# Altium schematic sheet InputCurrentSensingSketch.SchDoc
size A4; SheetNumber: 4; SheetTotal: 8
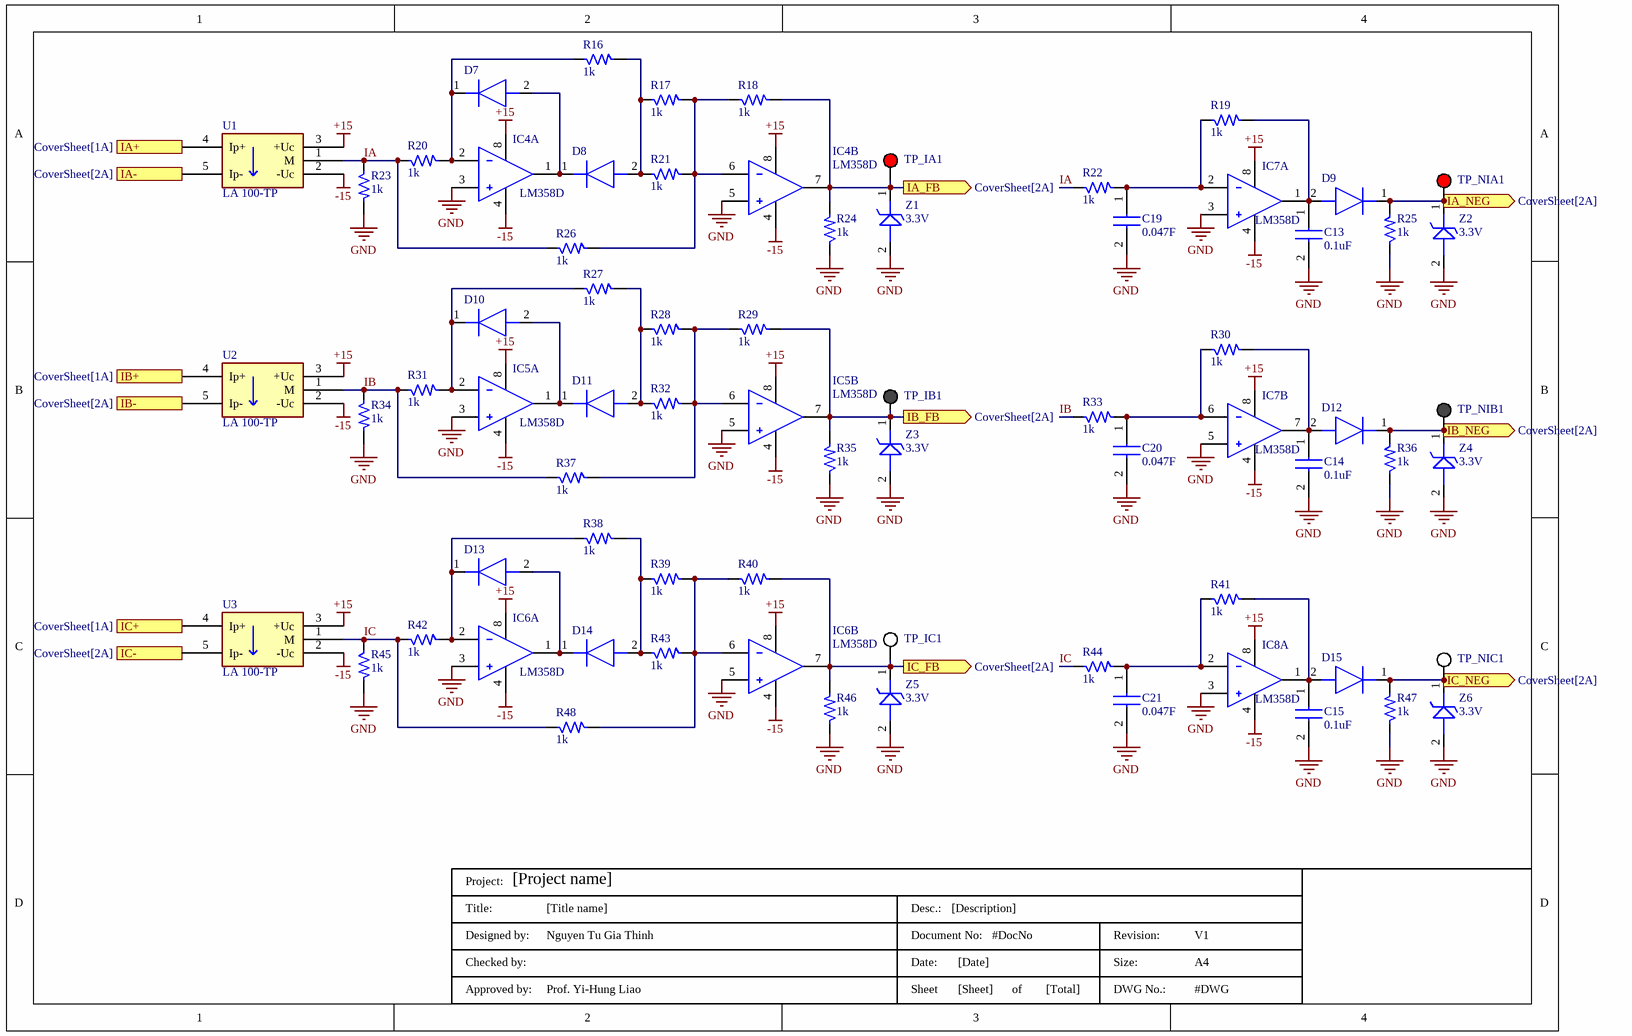
[diagram p0: InputCurrentSensingSketch.SchDoc]

## Parts
C13  0.1uF  [C0805]
C14  0.1uF  [C0805]
C15  0.1uF  [C0805]
C19  value 0.047F  [C0805]  (hidden comment: C0805C473F3GECAUTO7210)
C20  value 0.047F  [C0805]  (hidden comment: C0805C473F3GECAUTO7210)
C21  value 0.047F  [C0805]  (hidden comment: C0805C473F3GECAUTO7210)
D7  MBRM130LT1G  [MBRM130LT1G]  (value not drawn)
D8  MBRM130LT1G  [MBRM130LT1G]  (value not drawn)
D9  MBRM130LT1G  [MBRM130LT1G]  (value not drawn)
D10  MBRM130LT1G  [MBRM130LT1G]  (value not drawn)
D11  MBRM130LT1G  [MBRM130LT1G]  (value not drawn)
D12  MBRM130LT1G  [MBRM130LT1G]  (value not drawn)
D13  MBRM130LT1G  [MBRM130LT1G]  (value not drawn)
D14  MBRM130LT1G  [MBRM130LT1G]  (value not drawn)
D15  MBRM130LT1G  [MBRM130LT1G]  (value not drawn)
IC4  LM358D  [SOIC127P600X175-8N]  (parts A,B of 2)
IC5  LM358D  [SOIC127P600X175-8N]  (parts A,B of 2)
IC6  LM358D  [SOIC127P600X175-8N]  (parts A,B of 2)
IC7  LM358D  [SOIC127P600X175-8N]  (parts A,B of 2)
IC8  LM358D  [SOIC127P600X175-8N]  (part A of 2)
R16  1k  [SM-1206]
R17  1k  [SM-1206]
R18  1k  [SM-1206]
R19  1k  [SM-1206]
R20  1k  [SM-1206]
R21  1k  [SM-1206]
R22  1k  [SM-1206]
R23  1k  [SM-1206]
R24  1k  [SM-1206]
R25  1k  [SM-1206]
R26  1k  [SM-1206]
R27  1k  [SM-1206]
R28  1k  [SM-1206]
R29  1k  [SM-1206]
R30  1k  [SM-1206]
R31  1k  [SM-1206]
R32  1k  [SM-1206]
R33  1k  [SM-1206]
R34  1k  [SM-1206]
R35  1k  [SM-1206]
R36  1k  [SM-1206]
R37  1k  [SM-1206]
R38  1k  [SM-1206]
R39  1k  [SM-1206]
R40  1k  [SM-1206]
R41  1k  [SM-1206]
R42  1k  [SM-1206]
R43  1k  [SM-1206]
R44  1k  [SM-1206]
R45  1k  [SM-1206]
R46  1k  [SM-1206]
R47  1k  [SM-1206]
R48  1k  [SM-1206]
TitleBlock  DWG No.: #DWG  Size:: A4  Revision:: V1  Total of Sheets: [Total]  Sheet: [Sheet]  Date:: [Date]  Document No:: #DocNo  Desc.:: [Description]  Approved by:: Prof. Yi-Hung Liao  Designed by:: Nguyen Tu Gia Thinh  Title:: [Title name]  Project: [Project name]  (hidden comment: TitleBlock)  (graphical)
TP_IA1  (no value)  [5000]
TP_IB1  (no value)  [5001]
TP_IC1  (no value)  [5002]
TP_NIA1  (no value)  [5000]
TP_NIB1  (no value)  [5001]
TP_NIC1  (no value)  [5002]
U1  LA 100-TP  [LA 100-TP]
U2  LA 100-TP  [LA 100-TP]
U3  LA 100-TP  [LA 100-TP]
Z1  3.3V  [DIOM5226X230N]
Z2  3.3V  [DIOM5226X230N]
Z3  3.3V  [DIOM5226X230N]
Z4  3.3V  [DIOM5226X230N]
Z5  3.3V  [DIOM5226X230N]
Z6  3.3V  [DIOM5226X230N]

## Ports
IA+ (in, see CoverSheet[1A]), IA- (out, see CoverSheet[2A]), IA_FB (out, see CoverSheet[2A]), IA_NEG (out, see CoverSheet[2A]), IB+ (in, see CoverSheet[1A]), IB- (out, see CoverSheet[2A]), IB_FB (out, see CoverSheet[2A]), IB_NEG (out, see CoverSheet[2A]), IC+ (in, see CoverSheet[1A]), IC- (out, see CoverSheet[2A]), IC_FB (out, see CoverSheet[2A]), IC_NEG (out, see CoverSheet[2A])

## Nets
+15: IC4.8(V+) IC5.8(V+) IC6.8(V+) IC7.8(V+) IC8.8(V+) U1.3(+Uc) U2.3(+Uc) U3.3(+Uc)
-15: IC4.4(V-) IC5.4(V-) IC6.4(V-) IC7.4(V-) IC8.4(V-) U1.2(-Uc) U2.2(-Uc) U3.2(-Uc)
GND: C13.2 C14.2 C15.2 C19.2 C20.2 C21.2 IC4.3(IN1+) IC4.5(IN2+) IC5.3(IN1+) IC5.5(IN2+) IC6.3(IN1+) IC6.5(IN2+) IC7.3(IN1+) IC7.5(IN2+) IC8.3(IN1+) R23.2 R24.1 R25.1 R34.2 R35.1 R36.1 R45.2 R46.1 R47.1 Z1.2(A) Z2.2(A) Z3.2(A) Z4.2(A) Z5.2(A) Z6.2(A)
IA: R20.1 R22.1 R23.1 R26.1 U1.1(M)
IA+: U1.4(Ip+) ; port IA+
IA-: U1.5(Ip-) ; port IA-
IA_FB: IC4.7(OUT2) R18.2 R24.2 TP_IA1.1 Z1.1(K) ; port IA_FB
IA_NEG: D9.1(K) R25.2 TP_NIA1.1 Z2.1(K) ; port IA_NEG
IB: R31.1 R33.1 R34.1 R37.1 U2.1(M)
IB+: U2.4(Ip+) ; port IB+
IB-: U2.5(Ip-) ; port IB-
IB_FB: IC5.7(OUT2) R29.2 R35.2 TP_IB1.1 Z3.1(K) ; port IB_FB
IB_NEG: D12.1(K) R36.2 TP_NIB1.1 Z4.1(K) ; port IB_NEG
IC: R42.1 R44.1 R45.1 R48.1 U3.1(M)
IC+: U3.4(Ip+) ; port IC+
IC-: U3.5(Ip-) ; port IC-
IC_FB: IC6.7(OUT2) R40.2 R46.2 TP_IC1.1 Z5.1(K) ; port IC_FB
IC_NEG: D15.1(K) R47.2 TP_NIC1.1 Z6.1(K) ; port IC_NEG
NetC13_1: C13.1 D9.2(A) IC7.1(OUT1) R19.2
NetC14_1: C14.1 D12.2(A) IC7.7(OUT2) R30.2
NetC15_1: C15.1 D15.2(A) IC8.1(OUT1) R41.2
NetC19_1: C19.1 IC7.2(IN1-) R19.1 R22.2
NetC20_1: C20.1 IC7.6(IN2-) R30.1 R33.2
NetC21_1: C21.1 IC8.2(IN1-) R41.1 R44.2
NetD7_1: D7.1(K) IC4.2(IN1-) R16.1 R20.2
NetD7_2: D7.2(A) D8.1(K) IC4.1(OUT1)
NetD8_2: D8.2(A) R16.2 R17.1 R21.1
NetD10_1: D10.1(K) IC5.2(IN1-) R27.1 R31.2
NetD10_2: D10.2(A) D11.1(K) IC5.1(OUT1)
NetD11_2: D11.2(A) R27.2 R28.1 R32.1
NetD13_1: D13.1(K) IC6.2(IN1-) R38.1 R42.2
NetD13_2: D13.2(A) D14.1(K) IC6.1(OUT1)
NetD14_2: D14.2(A) R38.2 R39.1 R43.1
NetIC4_6: IC4.6(IN2-) R17.2 R18.1 R21.2 R26.2
NetIC5_6: IC5.6(IN2-) R28.2 R29.1 R32.2 R37.2
NetIC6_6: IC6.6(IN2-) R39.2 R40.1 R43.2 R48.2

## Notes on the sheet
- (in symbol Title Block 2) Project:; Title:; Desc.:; Designed by:; Document No:; Revision:; Checked by:; Date:; Size:; Approved by:; Sheet; of; DWG No.:

## Library data of the parts
C13-C15 = C0805C104K3RACTU: Capacitor; Manufacturer_Name: KEMET; Datasheet Link: https://content.kemet.com/datasheets/KEM_C1002_X7R_SMD.pdf; Height: 1.1mm; Manufacturer_Part_Number: C0805C104K3RACTU; Mouser Part Number: 80-C0805C104K3R; Mouser Price/Stock: https://www.mouser.co.uk/ProductDetail/KEMET/C0805C104K3RACTU?qs=zZwvocWqSRjmUvfNxkIN%2Fg%3D%3D; Arrow Part Number: C0805C104K3RACTU; Arrow Price/Stock: https://www.arrow.com/en/products/c0805c104k3ractu/kemet-corporation; Capacitance: 0.1uF
C19-C21 = C0805C473F3GECAUTO7210: Capacitor; Manufacturer_Name: KEMET; Datasheet Link: https://content.kemet.com/datasheets/KEM_C1091_C0G_ESD.pdf; Height: 1.1mm; Manufacturer_Part_Number: C0805C473F3GECAUTO7210; Mouser Part Number: 80-C0805C473F3GEAULR; Mouser Price/Stock: https://www.mouser.co.uk/ProductDetail/KEMET/C0805C473F3GECAUTO7210?qs=55YtniHzbhCk%252BaMpaMvfmA%3D%3D
D7-D15 = MBRM130LT1G: Diode; Manufacturer_Name: onsemi; Datasheet Link: http://www.onsemi.com/pub/Collateral/MBRM130L-D.PDF; Manufacturer_Part_Number: MBRM130LT1G; Mouser Part Number: 863-MBRM130LT1G; Mouser Price/Stock: https://www.mouser.co.uk/ProductDetail/onsemi/MBRM130LT1G?qs=3JMERSakebrXPEmSbT3BNg%3D%3D; Arrow Part Number: MBRM130LT1G; Arrow Price/Stock: https://www.arrow.com/en/products/mbrm130lt1g/on-semiconductor?region=europe
IC4-IC8 = LM358D: Integrated Circuit; Manufacturer_Name: Texas Instruments; Datasheet Link: http://www.ti.com/lit/ds/symlink/lm358.pdf; Height: 1.75mm; Manufacturer_Part_Number: LM358D; Mouser Part Number: 595-LM358D; Mouser Price/Stock: https://www.mouser.co.uk/ProductDetail/Texas-Instruments/LM358D?qs=X1HXWTtiZ0RJBM%2FvBfVo8g%3D%3D; Arrow Part Number: LM358D; Arrow Price/Stock: https://www.arrow.com/en/products/lm358d/texas-instruments?region=nac
R16-R48 = R: Resistor 1/4W; Value: R1/4W - 1K
TitleBlock = Title Block 2
TP_IA1 TP_NIA1 = 5000: Test Point Red, Multipurpose, TH
TP_IB1 TP_NIB1 = 5001: Test Point Black, Multipurpose, TH
TP_IC1 TP_NIC1 = 5002: Test Point White, Multipurpose, TH
U1-U3 = LA 100-TP: Current Transducer, AC/AC, 100A
Z1-Z6 = BZG05C3V3-HM3-08: Zener Diode; Manufacturer_Name: Vishay; Datasheet Link: https://www.vishay.com/doc?86135; Height: 2.3mm; Manufacturer_Part_Number: BZG05C3V3-HM3-08; Mouser Part Number: 78-BZG05C3V3-HM3-08; Mouser Price/Stock: https://www.mouser.co.uk/ProductDetail/Vishay-Semiconductors/BZG05C3V3-HM3-08?qs=W0yvOO0ixfFdOsuRX87wbg%3D%3D; Arrow Part Number: BZG05C3V3-HM3-08; Arrow Price/Stock: https://www.arrow.com/en/products/bzg05c3v3-hm3-08/vishay?region=nac